# Altium schematic sheet misc.SchDoc
size 381 x 241 mm; SheetNumber: 2; SheetTotal: 2
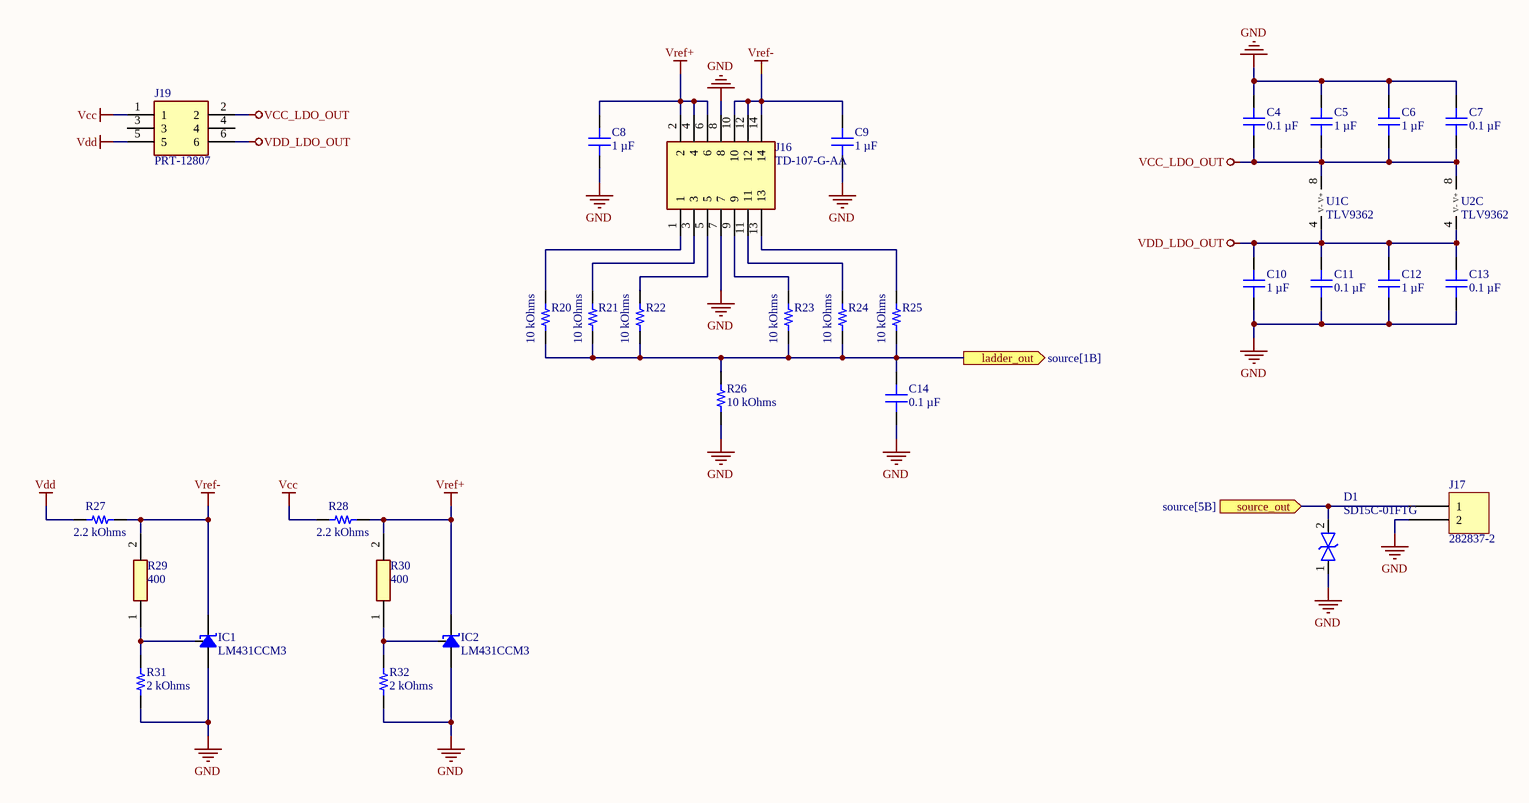
[diagram p0: misc.SchDoc]

## Parts
C4  0.1 µF  [CAP 1206_3216 - 0.8MM]
C5  1 µF  [CAP 1206_3216 - 0.8MM]
C6  1 µF  [CAP 1206_3216 - 0.8MM]
C7  0.1 µF  [CAP 1206_3216 - 0.8MM]
C8  1 µF  [CAP 1206_3216 - 0.8MM]
C9  1 µF  [CAP 1206_3216 - 0.8MM]
C10  1 µF  [CAP 1206_3216 - 0.8MM]
C11  0.1 µF  [CAP 1206_3216 - 0.8MM]
C12  1 µF  [CAP 1206_3216 - 0.8MM]
C13  0.1 µF  [CAP 1206_3216 - 0.8MM]
C14  0.1 µF  [CAP 1206_3216 - 0.8MM]
D1  SD15C-01FTG  [SD15C01FTG]
IC1  LM431CCM3  [SOT96P240X110-3N]
IC2  LM431CCM3  [SOT96P240X110-3N]
J16  TD-107-G-AA  [HDRV14W46P254_2X7_1778X508X818P]
J17  282837-2  [TE 282837-2]
J19  PRT-12807  [HDRV6W82P254_2X3_762X500X884P]
R20  10 kOhms  [YAGEO RES 1206_3216]
R21  10 kOhms  [YAGEO RES 1206_3216]
R22  10 kOhms  [YAGEO RES 1206_3216]
R23  10 kOhms  [YAGEO RES 1206_3216]
R24  10 kOhms  [YAGEO RES 1206_3216]
R25  10 kOhms  [YAGEO RES 1206_3216]
R26  10 kOhms  [YAGEO RES 1206_3216]
R27  2.2 kOhms  [RES 1206_3216]
R28  2.2 kOhms  [RES 1206_3216]
R29  400  [RESC3116X65N]
R30  400  [RESC3116X65N]
R31  2 kOhms  [RES 1206_3216]
R32  2 kOhms  [RES 1206_3216]
U1  TLV9362  [SOIC8-127P600X175-8N]  (part C of 3)
U2  TLV9362  [SOIC8-127P600X175-8N]  (part C of 3)

## Ports
ladder_out (out, see source[1B]), source_out (in, see source[5B])

## Nets
GND: C4.1 C5.1 C6.2 C7.2 C8.2 C9.1 C10.2 C11.2 C12.2 C13.2 C14.2 D1.1 IC1.2(Anode) IC2.2(Anode) J16.7 J16.8 J17.2 R26.1 R31.1 R32.1
Vcc: J19.1 R28.1
VCC_LDO_OUT: C4.2 C5.2 C6.1 C7.1 J19.2 U1.8(V+) U2.8(V+)
Vdd: J19.5 R27.1
VDD_LDO_OUT: C10.1 C11.1 C12.1 C13.1 J19.6 U1.4(V-) U2.4(V-)
Vref+: C8.1 IC2.1(Cathode) J16.2 J16.4 J16.6 R28.2 R30.2
Vref-: C9.2 IC1.1(Cathode) J16.10 J16.12 J16.14 R27.2 R29.2
ladder_out: C14.1 R20.1 R21.1 R22.1 R23.1 R24.1 R25.1 R26.2 ; port ladder_out
source_out: D1.2 J17.1 ; port source_out
NetIC1_3: IC1.3(Ref) R29.1 R31.2
NetIC2_3: IC2.3(Ref) R30.1 R32.2
NetJ16_1: J16.1 R20.2
NetJ16_3: J16.3 R21.2
NetJ16_5: J16.5 R22.2
NetJ16_9: J16.9 R23.2
NetJ16_11: J16.11 R24.2
NetJ16_13: J16.13 R25.2

Not connected (* = marked no-connect by the designer): J19 3 4

## Library data of the parts
C4 C7 C11 C13 C14 = 885012208087: CAP CER 0.1UF 50V X7R 1206; manufacturer: Würth Elektronik; Tolerance: ±10%; Part Number: 885012208087; Capacitance: 0.1 µF; Applications: General Purpose; componentlink1description: Datasheet; componentlink1url: https://katalog.we-online.de/pbs/datasheet/885012208087.pdf; componentlink2description: DigiKey Link; componentlink2url: https://www.digikey.com/en/products/detail/würth-elektronik/885012208087/5453982; Device Package: 1206 (3216 Metric); lastupdated: 6/4/2024 19:10:27; Lifecycle Status: Active; Minimum Order: 1; Mounting Type: Surface Mount, MLCC; Operating Temperature: -55°C ~ 125°C; Package / Case: 1206 (3216 Metric); packaging: TapeAndReel; partid: 20879; Part Status: Active; price: 0.06; series: WCAP-CSGP; Size / Dimension: 0.126" L x 0.063" W (3.20mm x 1.60mm); Supplier 1: DigiKey; Supplier Part Number 1: 732-8127-1-ND; Temperature Coefficient: X7R; Thickness (Max): 0.035" (0.90mm); value: 0.1 µF; Voltage - Rated: 50V
C5 C6 C8-C10 C12 = 885012208093: CAP CER 1UF 50V X7R 1206; manufacturer: Würth Elektronik; Tolerance: ±10%; Part Number: 885012208093; Capacitance: 1 µF; Applications: General Purpose; componentlink1description: Datasheet; componentlink1url: https://katalog.we-online.de/pbs/datasheet/885012208093.pdf; componentlink2description: DigiKey Link; componentlink2url: https://www.digikey.com/en/products/detail/würth-elektronik/885012208093/5453432; Device Package: 1206 (3216 Metric); lastupdated: 6/4/2024 19:10:33; Lifecycle Status: Active; Minimum Order: 1; Mounting Type: Surface Mount, MLCC; Operating Temperature: -55°C ~ 125°C; Package / Case: 1206 (3216 Metric); packaging: TapeAndReel; partid: 39665; Part Status: Active; price: 0.10; series: WCAP-CSGP; Size / Dimension: 0.126" L x 0.063" W (3.20mm x 1.60mm); Supplier 1: DigiKey; Supplier Part Number 1: 732-7577-1-ND; Temperature Coefficient: X7R; Thickness (Max): 0.075" (1.90mm); value: 1 µF; Voltage - Rated: 50V
D1 = SD15C-01FTG: TVS Diode (Bi-directional); Manufacturer_Name: LITTELFUSE; Datasheet Link: https://www.arrow.com/en/products/sd15c-01ftg/littelfuse; Height: 1.14mm; Manufacturer_Part_Number: SD15C-01FTG; Mouser Part Number: 576-SD15C-01FTG; Mouser Price/Stock: https://www.mouser.co.uk/ProductDetail/Littelfuse/SD15C-01FTG?qs=4zl93aaztU8pjSvpxpJP6g%3D%3D; Arrow Part Number: SD15C-01FTG; Arrow Price/Stock: https://www.arrow.com/en/products/sd15c-01ftg/littelfuse?region=nac
IC1 IC2 = LM431CCM3_NOPB: Integrated Circuit; Manufacturer_Name: Texas Instruments; Manufacturer_Part_Number: LM431CCM3/NOPB; Datasheet Link: http://www.ti.com/lit/gpn/lm431; Height: 1.12mm; Mouser Part Number: 926-LM431CCM3/NOPB; Mouser Price/Stock: https://www.mouser.co.uk/ProductDetail/Texas-Instruments/LM431CCM3-NOPB?qs=QbsRYf82W3GICygfDXnqiw%3D%3D; Arrow Part Number: LM431CCM3/NOPB; Arrow Price/Stock: https://www.arrow.com/en/products/lm431ccm3nopb/texas-instruments?utm_currency=USD&region=nac
J16 = TD-107-G-AA: Connector; Manufacturer_Name: SAMTEC; Datasheet Link: https://suddendocs.samtec.com/catalog_english/td.pdf?_gl=1*1wt4qt0*_ga*MTEzMjQwMzYxOS4xNjk3ODEzMDcx*_ga_3KFNZC07WW*MTcxMjgzNDUyOC40My4xLjE3MTI4MzQ1ODguNjAuMC4w; Height: 8.18mm; Manufacturer_Part_Number: TD-107-G-AA; Mouser Part Number: 200-TD107GAA; Mouser Price/Stock: https://www.mouser.co.uk/ProductDetail/Samtec/TD-107-G-AA?qs=0lQeLiL1qybxLJvA9lDIZA%3D%3D; Arrow Part Number: TD-107-G-AA; Arrow Price/Stock: https://www.arrow.com/en/products/td-107-g-aa/samtec
J17 = 282837-2: TERM BLK 2P SIDE ENT 5.08MM PCB; Manufacturer: TE Connectivity AMP Connectors; Current: 13.5 A; Mating Orientation: Horizontal with Board; Number of Levels: 1; Pitch: 0.200" (5.08mm); Positions Per Level: 2; Voltage: 300 V; Wire Gauge: 16-28 AWG; Wire Termination: Screw - Rising Cage Clamp; Part Number: 282837-2; Color: Green; ComponentLink1Description: Datasheet; ComponentLink1URL: https://www.te.com/commerce/DocumentDelivery/DDEController?Action=srchrtrv&DocNm=282837&DocType=Customer+Drawing&DocLang=English; ComponentLink2Description: DigiKey Link; ComponentLink2URL: https://www.digikey.com/en/products/detail/te-connectivity-amp-connectors/282837-2/2187973; Features: Interlocking (Side); LastUpdated: 6/21/2022 15:00:23; Lifecycle Status: Active; Minimum Order: 1; Mounting Type: Through Hole; Packaging: Tray; Part Status: Active; Price: 0.31; Series: Buchanan; Supplier 1: DigiKey; Supplier Part Number 1: A113320-ND
J19 = PRT-12807: Connector; Manufacturer_Name: SparkFun; Datasheet Link: https://cdn.sparkfun.com/datasheets/Prototyping/00989.pdf; Height: 8.84mm; Manufacturer_Part_Number: PRT-12807; Mouser Part Number: 474-PRT-12807; Mouser Price/Stock: https://www.mouser.co.uk/ProductDetail/SparkFun/PRT-12807?qs=WyAARYrbSnYnpz4kKzOm4A%3D%3D; Arrow Part Number: PRT-12807; Arrow Price/Stock: https://www.arrow.com/en/products/prt-12807/sparkfun-electronics
R20-R26 = RT1206FRE0710KL: RES SMD 10K OHM 1% 1/4W 1206; Manufacturer: Yageo; Power (Watts): 0.25W, 1/4W; Temperature Coefficient: ±50ppm/°C; Part Number: RT1206FRE0710KL; ComponentLink1Description: Datasheet; ComponentLink1URL: https://www.yageo.com/upload/media/product/productsearch/datasheet/rchip/PYu-RT_1-to-0.01_RoHS_L_11.pdf; ComponentLink2Description: DigiKey Link; ComponentLink2URL: https://www.digikey.com/en/products/detail/yageo/RT1206FRE0710KL/1082868; Composition: Thin Film; Device Package: 1206 (3216 Metric); Height - Seated (Max): 0.026" (0.65mm); LastUpdated: 7/25/2024 09:21:28; Lifecycle Status: Active; Minimum Order: 1; Number of Terminations: 2; Operating Temperature: -55°C ~ 155°C; Package / Case: 1206 (3216 Metric); Packaging: TapeAndReel; PartId: 38903; Part Status: Active; Price: 0.01; Resistance: 10 kOhms; Series: RT; Size / Dimension: 0.122" L x 0.063" W (3.10mm x 1.60mm); Supplier 1: DigiKey; Supplier Part Number 1: YAG1242CT-ND; Supplier Device Package: 1206; Tolerance: ±1%; Value: 10 kOhms
R27 R28 = ERJ-8GEYJ222V: RES SMD 2.2K OHM 5% 1/4W 1206; Manufacturer: Panasonic Electronic Components; Power (Watts): 0.25W, 1/4W; Temperature Coefficient: ±200ppm/°C; Part Number: ERJ-8GEYJ222V; ComponentLink1Description: Datasheet; ComponentLink1URL: http://industrial.panasonic.com/www-cgi/jvcr13pz.cgi?E+PZ+3+AOA0001+ERJ8GEYJ222V+7+WW; ComponentLink2Description: DigiKey Link; ComponentLink2URL: https://www.digikey.com/en/products/detail/panasonic-electronic-components/ERJ-8GEYJ222V/10357; Composition: Thick Film; Device Package: 1206 (3216 Metric); Features: Automotive AEC-Q200; Height - Seated (Max): 0.028" (0.70mm); LastUpdated: 2/9/2024 20:54:10; Lifecycle Status: Active; Minimum Order: 1; Number of Terminations: 2; Operating Temperature: -55°C ~ 155°C; Package / Case: 1206 (3216 Metric); Packaging: TapeAndReel; PartId: 35911; Part Status: Active; Price: 0.02; Ratings: AEC-Q200; Resistance: 2.2 kOhms; Series: ERJ-8G; Size / Dimension: 0.126" L x 0.063" W (3.20mm x 1.60mm); Supplier 1: DigiKey; Supplier Part Number 1: P2.2KECT-ND; Supplier Device Package: 1206; Tolerance: ±5%; Value: 2.2 kOhms
R29 R30 = RT1206BRD07400RL: Resistor; Manufacturer_Name: YAGEO; Datasheet Link: https://www.mouser.fr/datasheet/2/447/PYu_RT_1_to_0_01_RoHS_L_15-3461507.pdf; Height: 0.65mm; Manufacturer_Part_Number: RT1206BRD07400RL; Mouser Part Number: 603-RT1206BRD07400RL; Mouser Price/Stock: https://www.mouser.co.uk/ProductDetail/YAGEO/RT1206BRD07400RL?qs=NgbZBzc1CyGp8d%2FABgImbQ%3D%3D; Arrow Part Number: RT1206BRD07400RL; Arrow Price/Stock: null?region=nac
R31 R32 = ERA-8AEB202V: RES SMD 2K OHM 0.1% 1/4W 1206; Manufacturer: Panasonic Electronic Components; Power (Watts): 0.25W, 1/4W; Temperature Coefficient: ±25ppm/°C; Part Number: ERA-8AEB202V; ComponentLink1Description: Datasheet; ComponentLink1URL: https://industrial.panasonic.com/cdbs/www-data/pdf/RDM0000/AOA0000C307.pdf; ComponentLink2Description: DigiKey Link; ComponentLink2URL: https://www.digikey.com/en/products/detail/panasonic-electronic-components/ERA-8AEB202V/3070866; Composition: Thin Film; Device Package: 1206 (3216 Metric); Features: Automotive AEC-Q200; Height - Seated (Max): 0.028" (0.70mm); LastUpdated: 2/9/2024 20:54:17; Lifecycle Status: Active; Minimum Order: 1; Number of Terminations: 2; Operating Temperature: -55°C ~ 155°C; Package / Case: 1206 (3216 Metric); Packaging: TapeAndReel; PartId: 34011; Part Status: Active; Price: 0.10; Ratings: AEC-Q200; Resistance: 2 kOhms; Series: ERA-8A; Size / Dimension: 0.126" L x 0.063" W (3.20mm x 1.60mm); Supplier 1: DigiKey; Supplier Part Number 1: P2.0KBCCT-ND; Supplier Device Package: 1206; Tolerance: ±0.1%; Value: 2 kOhms
U1 U2 = TLV9362: TLV936x 10-MHz, 40-V, RRO, Operational Amplifie; ComponentLink1Description: Datasheet; ComponentLink1URL: https://www.ti.com/lit/ds/symlink/tlv9362.pdf